# Altium schematic sheet Power Manengement.SchDoc: Wireles Securty Detector
size 420 x 297 mm; Date: 04.01.2024; CheckedBy: Arda B.; DrawnBy: Arda Bozkurt; DocumentNumber: 3; Revision: 001; SheetNumber: 3; SheetTotal: 5; Size: A3; Department: HDD
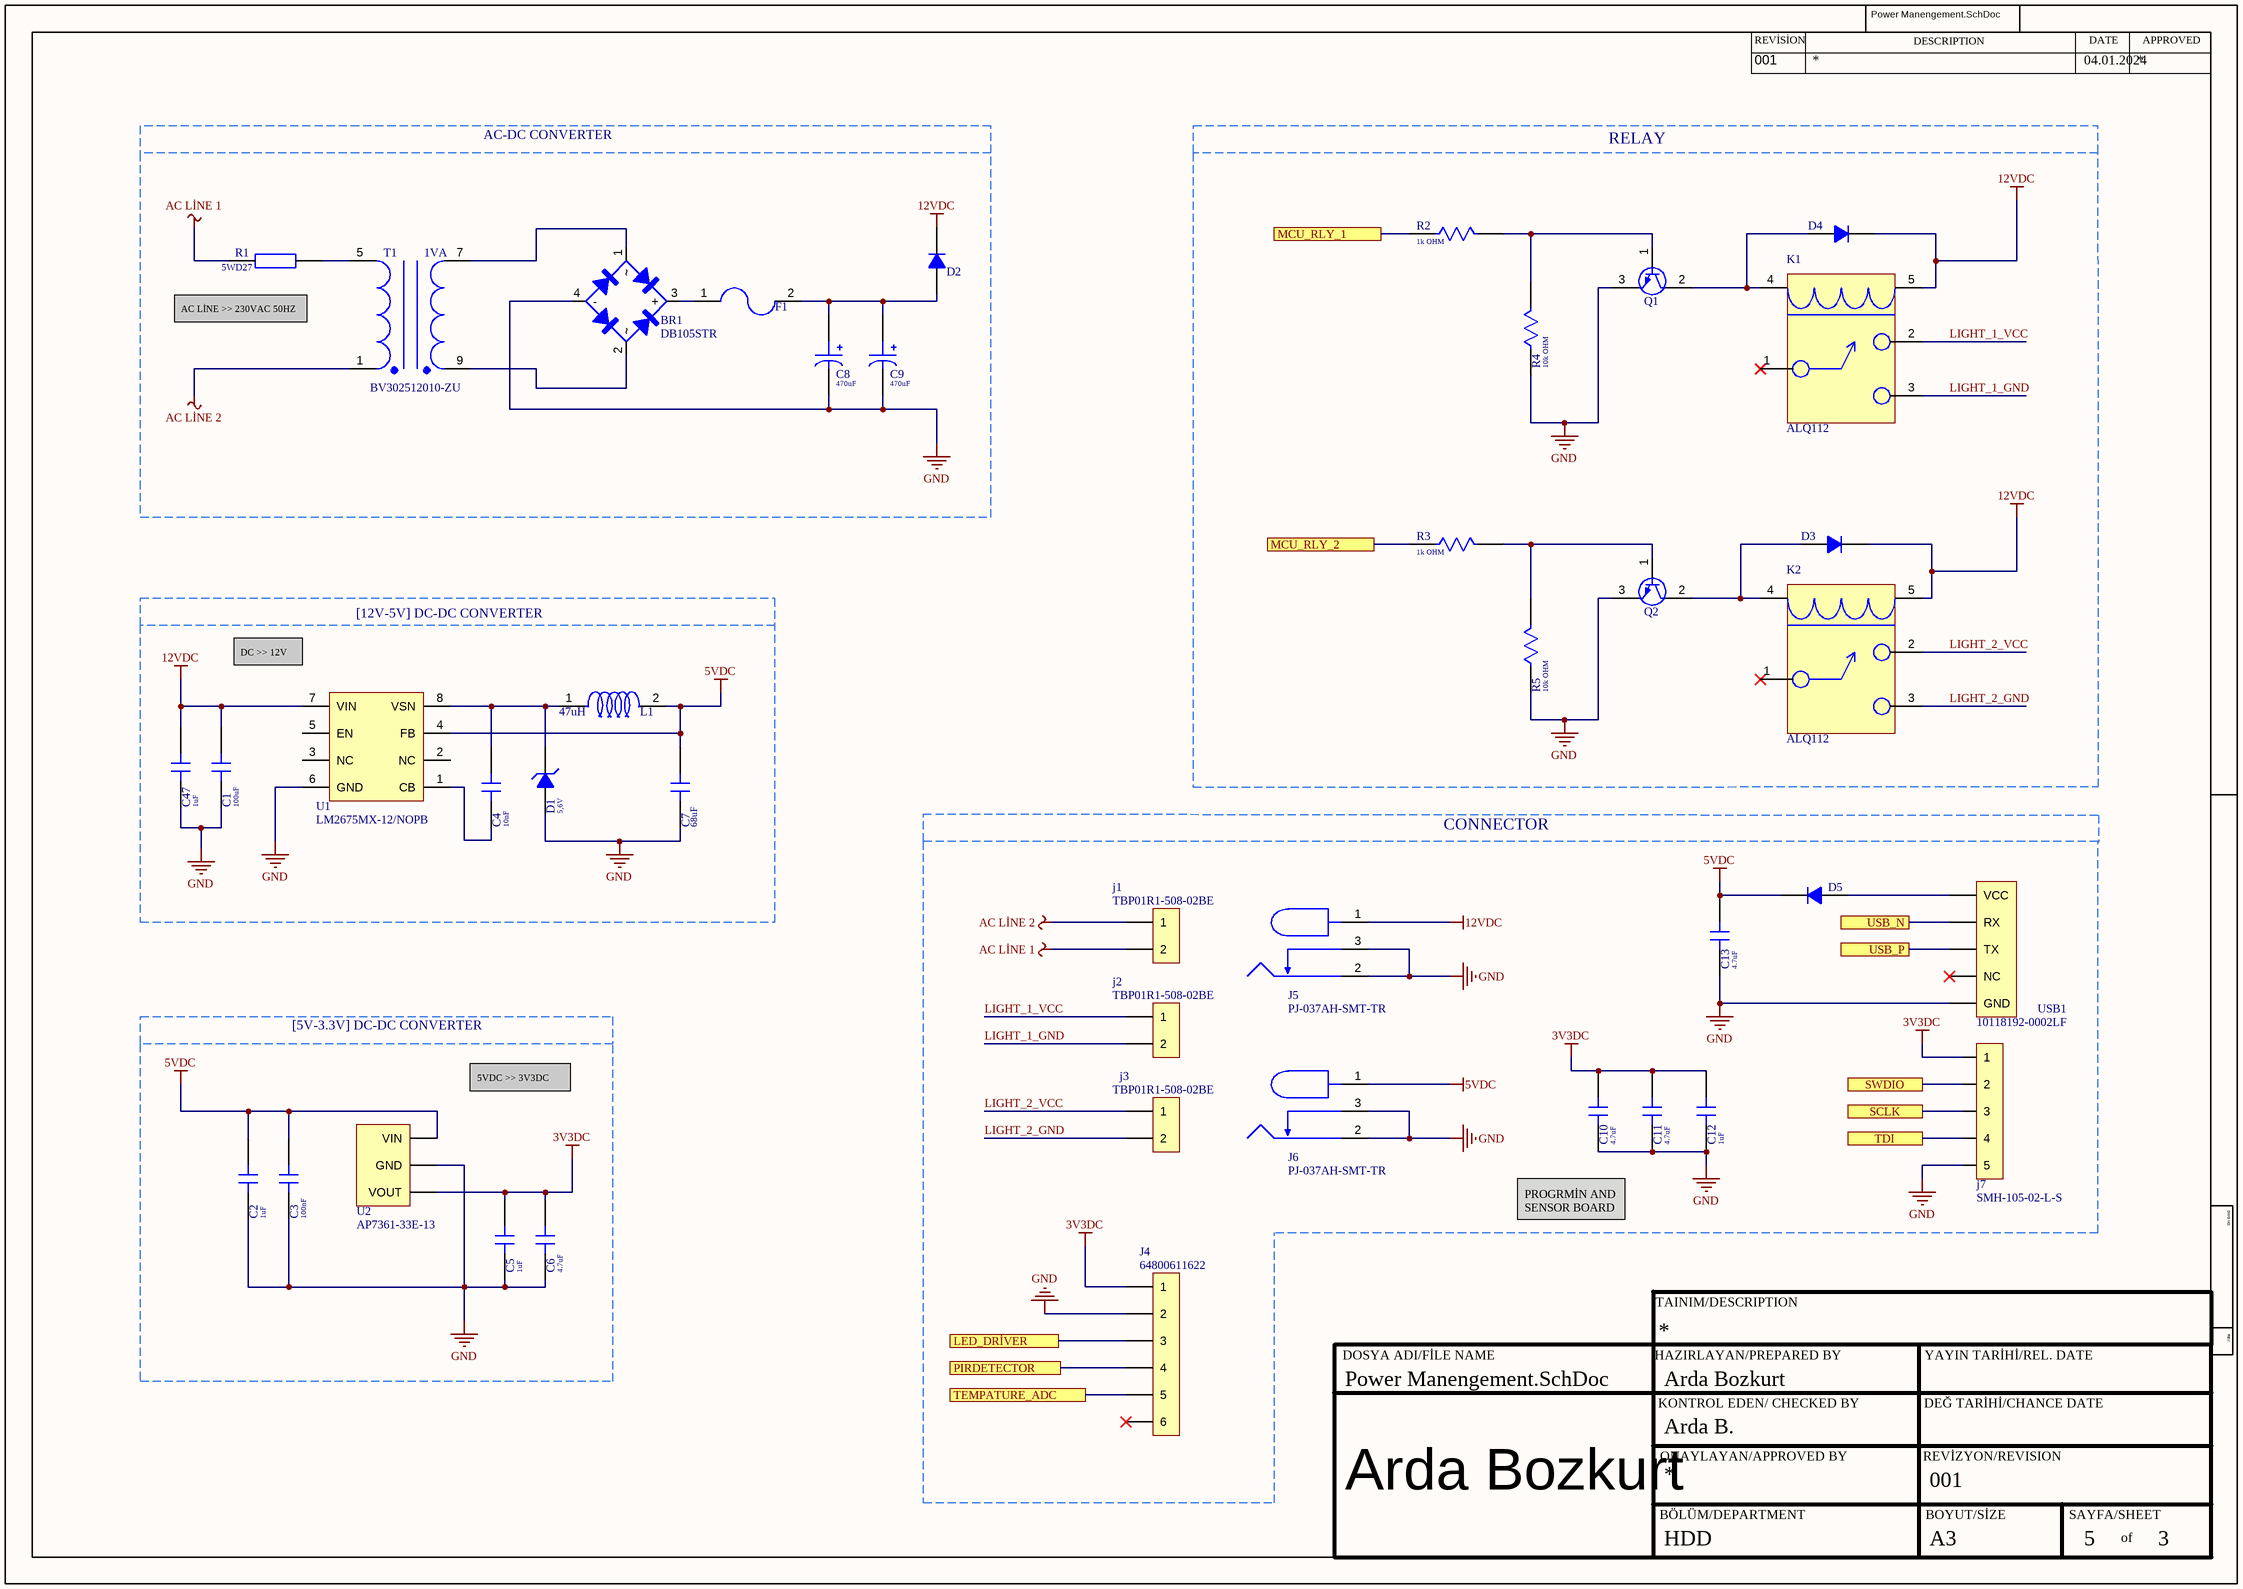
[diagram p0: Power Manengement.SchDoc]

## Parts
BR1  DB105STR  [DB105STR]
C1  value 100uF  [CAP-0805]  (hidden comment: GRM21BR60G107ME11K)
C2  value 1uF  [CAP-0805]  (hidden comment: CL21B105KAFNNNE)
C3  value 100nF  [CAP-0603]  (hidden comment: C0603C104KRACTU)
C4  value 10nF  [CAP-0603]  (hidden comment: 0603B103K160CT)
C5  value 1uF  [CAP-0805]  (hidden comment: CL21B105KAFNNNE)
C6  value 4.7uF  [CAP-0805]  (hidden comment: CL21A475KAQNNNE)
C7  value 68uF  [CAP ALUM HYB 68UF 20% 35V SMD]  (hidden comment: EEV686M035A9HAA)
C8  value 470uF  [CAP_RADİAL_D1_PS]  (hidden comment: ESH477M050AH4AA)
C9  value 470uF  [CAP_RADİAL_D1_PS]  (hidden comment: ESH477M050AH4AA)
C10  value 4.7uF  [CAP-0805]  (hidden comment: CL21A475KAQNNNE)
C11  value 4.7uF  [CAP-0805]  (hidden comment: CL21A475KAQNNNE)
C12  value 1uF  [CAP-0805]  (hidden comment: CL21B105KAFNNNE)
C13  value 4.7uF  [CAP-0805]  (hidden comment: CL21A475KAQNNNE)
C47  value 1uF  [CAP-0805]  (hidden comment: CL21B105KAFNNNE)
D1  Workin Voltage: 5,6V  [DİODE403A-03]  (hidden comment: 1SMB5919BT3G)
D2  1N4148WS  [SOT-323]  (value not drawn)
D3  1N4148WS  [SOT-323]  (value not drawn)
D4  1N4148WS  [SOT-323]  (value not drawn)
D5  1N4148WS  [SOT-323]  (value not drawn)
F1  3413.0216.22  [FUSE-1206]  (value not drawn)
j1  TBP01R1-508-02BE  [TBP01R1-508-02BE]
j2  TBP01R1-508-02BE  [TBP01R1-508-02BE]
j3  TBP01R1-508-02BE  [TBP01R1-508-02BE]
J4  64800611622  [PİN_HEADER_1X6]
J5  PJ-037AH-SMT-TR  [JACK]
J6  PJ-037AH-SMT-TR  [JACK]
j7  SMH-105-02-L-S  [PİN HEADER 1X5 RA]
K1  ALQ112  [ALQ112]
K2  ALQ112  [ALQ112]
L1  value 47uH  [IND 1212]  (hidden comment: 78438335470)
Q1  MMBT3904-7-F  [SOT23-3]  (value not drawn)
Q2  MMBT3904-7-F  [SOT23-3]  (value not drawn)
R1  5WD27  [5WD27]
R2  value 1k OHM  [RES-0603]  (hidden comment: RMCF0603FT1K00)
R3  value 1k OHM  [RES-0603]  (hidden comment: RMCF0603FT1K00)
R4  value 10k OHM  [RES-0603]  (hidden comment: RC0603FR-0710KL)
R5  value 10k OHM  [RES-0603]  (hidden comment: RC0603FR-0710KL)
T1  BV302512010-ZU  Rated Power: 1VA  [BV302512010-ZU]
U1  LM2675MX-12/NOPB  [SOIC-8]
U2  AP7361-33E-13  [SOT223]
USB1  10118192-0002LF  [MİCRO_B_USB]

## Blocks framed on the sheet
AC-DC CONVERTER: BR1 C8 C9 D2 F1 R1 T1
RELAY: D3 D4 K1 K2 Q1 Q2 R2-R5
[12V-5V] DC-DC CONVERTER: C1 C4 C7 C47 D1 L1 U1

## Ports
LED_DRİVER (see Microcontroller[3B]), MCU_RLY_1 (see Microcontroller[3B]), MCU_RLY_2 (see Microcontroller[3B]), PIRDETECTOR (see Microcontroller[3B]), SCLK (see Microcontroller[1B]), SWDIO (see Microcontroller[1B]), TDI (see Microcontroller[1B]), TEMPATURE_ADC (see Microcontroller[1B]), USB_N (see Microcontroller[3A]), USB_P (see Microcontroller[3A])

## Nets
3V3DC: C5.2 C6.2 C10.2 C11.2 C12.2 J4.1 j7.1 U2.3(VOUT)
5VDC: C2.2 C3.2 C7.2 C13.2 D5.1 J6.1(VCC) L1.2 U1.4(FB) U2.1(VIN)
12VDC: C1.2 C47.2 D2.1 D3.1 D4.1 J5.1(VCC) K1.5 K2.5 U1.7(VIN)
AC LİNE 1: j1.2 R1.1
AC LİNE 2: j1.1 T1.1
GND: BR1.4(-) C1.1 C2.1 C3.1 C5.1 C6.1 C7.1 C8.2 C9.2 C10.1 C11.1 C12.1 C13.1 C47.1 D1.1 J4.2 J5.2(GND) J5.3(SH) J6.2(GND) J6.3(SH) j7.5 Q1.3(E) Q2.3(E) R4.1 R5.1 U1.6(GND) U2.2(GND) USB1.5(GND)
LED_DRİVER: J4.3 ; port LED_DRİVER
LIGHT_1_GND: j2.2 K1.3
LIGHT_1_VCC: j2.1 K1.2
LIGHT_2_GND: j3.2 K2.3
LIGHT_2_VCC: j3.1 K2.2
MCU_RLY_1: R2.1 ; port MCU_RLY_1
MCU_RLY_2: R3.1 ; port MCU_RLY_2
PIRDETECTOR: J4.4 ; port PIRDETECTOR
SCLK: j7.3 ; port SCLK
SWDIO: j7.2 ; port SWDIO
TDI: j7.4 ; port TDI
TEMPATURE_ADC: J4.5 ; port TEMPATURE_ADC
USB_N: USB1.2(RX) ; port USB_N
USB_P: USB1.3(TX) ; port USB_P
NetBR1_1: BR1.1 T1.7
NetBR1_2: BR1.2 T1.9
NetBR1_3: BR1.3(+) F1.1
NetC4_1: C4.1 D1.2 L1.1 U1.8(VSN)
NetC4_2: C4.2 U1.1(CB)
NetC8_1: C8.1 C9.1 D2.2 F1.2
NetD3_2: D3.2 K2.4 Q2.2(C)
NetD4_2: D4.2 K1.4 Q1.2(C)
NetD5_2: D5.2 USB1.1(VCC)
NetQ1_1: Q1.1(B) R2.2 R4.2
NetQ2_1: Q2.1(B) R3.2 R5.2
NetR1_2: R1.2 T1.5

Not connected (* = marked no-connect by the designer): J4 6*; K1 1 *; K2 1 *; U1 2(NC) 3(NC) 5(EN); USB1 4(NC)*

## Notes on the sheet
- (near R1) AC LİNE >> 230VAC 50HZ
- (near U1) DC >> 12V
- CONNECTOR
- [5V-3.3V] DC-DC CONVERTER
- 5VDC >> 3V3DC
- PROGRMİN AND SENSOR BOARD
- REVİSİON
- DESCRIPTION
- DATE
- APPROVED
- DWG NO:
- TAINIM/DESCRIPTION
- REV:
- DOSYA ADI/FİLE NAME
- HAZIRLAYAN/PREPARED BY
- KONTROL EDEN/ CHECKED BY
- YAYIN TARİHİ/REL. DATE
- DEĞ TARİHİ/CHANCE DATE
- ONAYLAYAN/APPROVED BY
- REVİZYON/REVISION
- Arda Bozkurt
- BÖLÜM/DEPARTMENT
- BOYUT/SİZE
- SAYFA/SHEET
- of

## Library data of the parts
BR1 = DB105STR: Bridge Rect 1PHASE 600V 1A Db-s; Manufacturer: Sangdest Microelectronics; Manufacturer Part Number: DB105S; Designed By: Arda B.; Supplier: Digi-Key; Supplier Part Number: 1655-DB105SCT-ND; RoHS: No; Category: Uncategorized; Stock: 16246; Pricing: 1=0,41, 10=0,29, 100=0,1464, 500=0,12978 (USD); Operating Voltage: 600V; Max Current: 1A
C1 = CAP CER 100uF 0805: Cap 100UF 4VDC X5R 20% SMD 0805 Embossed Tape; Manufacturer: Murata; Voltage Rating (DC): 4V; Designed By: Arda B.; Supplier: Digikey; Supplier Part Number: 490-GRM21BR60G107ME11KCT-ND; Manufacturer Part Number: GRM21BR60G107ME11K; RoHS: Yes; Category: Ceramic Capacitors; Stock: 12136; Pricing: 1=0,61, 10=0,409, 50=0,3256, 100=0,269, 500=0,21012, 1000=0,1786, 2500=0,1681, 5000=0,15759 (USD); Dielectric: X5R; Tolerance: 20%; Length: 2mm; Width: 1.25mm; Thickness: 1.25mm; RoHS Compliant: Yes
C2 C5 C12 C47 = CAP CER 1uF 0805: Multilayer Ceramic Capacitor, 1 uF, 25 V, ± 10%, X7R, 0805 [2012 Metric]; Manufacturer: Samsung; Voltage: 25V; Designed By: Arda B.; Supplier: Digi-Key; Supplier Part Number: 1276-1066-6-ND; Manufacturer Part Number: CL21B105KAFNNNE; RoHS: Yes; Category: Ceramic Capacitors; Stock: 1108684; Pricing: 1=0,1, 10=0,062, 50=0,0356, 100=0,0276, 500=0,02078, 1000=0,01633 (USD); Mounting Technology: Surface Mount; Case/Package: 0805; Case Code (Metric): 2012; Case Code (Imperial): 0805; Min Operating Temperature: -55°C; Max Operating Temperature: 125°C; Tolerance: 10%; Dielectric: X7R; Voltage Rating (DC): 25V; Series: CL; Packaging: Tape and Reel; Voltage Rating: 25V; Package Quantity: 1; Construction: Flat; Length: 2mm; Width: 0.049inch; Height: 1.25mm; Depth: 1.25mm; Thickness: 0.053inch; Radiation Hardening: No; Lead Free: Lead Free; RoHS Compliant: Yes; ComponentLink1URL: https://datasheet.ciiva.com/25800/cl21b105kafnnne-25800163.pdf?src-supplier=Digi-Key; ComponentLink1Description: https://datasheet.ciiva.com/25800/cl21b105kafnnne-25800163.pdf?src-supplier=Digi-Key; ComponentLink2URL: https://datasheet.ciiva.com/15195/getdatasheetpartid-355205-15195880.pdf?src-supplier=Verical; ComponentLink2Description: https://datasheet.ciiva.com/15195/getdatasheetpartid-355205-15195880.pdf?src-supplier=Verical
C3 = CAP CER 100nF 0603: Capacitor, 0.1UF, 100V, MLCC, 0603;; Manufacturer: KEMET; Manufacturer Part Number: C0603C104K1RACTU; Dielectric: 1511DielectricType; Designed By: Arda B.; Supplier: Digi-Key; Supplier Part Number: 399-C0603C104K1RACTUCT-ND; RoHS: No; Category: Ceramic Capacitors; Stock: 4405; Pricing: 1=0,28, 10=0,185, 50=0,1296, 100=0,1047, 500=0,07782, 1000=0,06808 (USD); Case/Package: 345Case; Voltage Rating (DC): 100V
C4 = CAP CER 10nF 0603: 0603 16V X7R .01uF 10% multilayer ceramic capacitor; Manufacturer: Walsin Technologies; Designed By: Arda B.; Supplier: Digi-Key; Supplier Part Number: 1292-1384-1-ND; Manufacturer Part Number: 0603B103K160CT; RoHS: Yes; Category: Ceramic Capacitors; Stock: 116602; Pricing: 1=0,1, 10=0,032, 50=0,0182, 100=0,0141, 500=0,0106, 1000=0,00833 (USD); Lead Free: 5697LeadFree; ComponentLink1URL: http://www.farnell.com/datasheets/1958513.pdf?src-supplier=Farnell; ComponentLink1Description: http://www.farnell.com/datasheets/1958513.pdf?src-supplier=Farnell; ComponentLink2URL: http://www.passivecomponent.com/wp-content/uploads/2018/10/MLCC.pdf?src-supplier=Digi-Key; ComponentLink2Description: http://www.passivecomponent.com/wp-content/uploads/2018/10/MLCC.pdf?src-supplier=Digi-Key; ComponentLink3URL: https://datasheet.octopart.com/0603B103K160CT-Walsin-Technologies-datasheet-85392065.pdf?src-supplier=Element14; ComponentLink3Description: https://datasheet.octopart.com/0603B103K160CT-Walsin-Technologies-datasheet-85392065.pdf?src-supplier=Element14; ComponentLink4URL: https://datasheet.octopart.com/0603B103K160CT-Walsin-Technologies-datasheet-136037192.pdf?src-supplier=Future+Electronics; ComponentLink4Description: https://datasheet.octopart.com/0603B103K160CT-Walsin-Technologies-datasheet-136037192.pdf?src-supplier=Future+Electronics; ComponentLink5URL: https://datasheet.octopart.com/0603B103K160CT-Walsin-Technologies-datasheet-62066062.pdf?src-supplier=TME; ComponentLink5Description: https://datasheet.octopart.com/0603B103K160CT-Walsin-Technologies-datasheet-62066062.pdf?src-supplier=TME
C6 C10 C11 C13 = CAP CER 4.7uF 0805: Multilayer Ceramic Capacitor, 4.7 uF, 25 V, ± 10%, X5R, 0805 [2012 Metric]; Manufacturer: Samsung; Voltage Rating: 25V; Designed By: Arda B.; Supplier: Digi-Key; Supplier Part Number: 1276-1244-1-ND; Manufacturer Part Number: CL21A475KAQNNNE; RoHS: Yes; Category: Ceramic Capacitors; Stock: 3410220; Pricing: 1=0,1, 10=0,069, 50=0,0414, 100=0,0326, 500=0,02408, 1000=0,01994 (USD); Mounting Technology: Surface Mount; Case/Package: 0805; Case Code (Metric): 2012; Case Code (Imperial): 0805; Material: Ceramic; Min Operating Temperature: -55°C; Max Operating Temperature: 85°C; Packaging: Tape and Reel; Tolerance: 10%; Dielectric: X5R; Voltage Rating (DC): 25V; Series: CL; Construction: Flat; Length: 2mm; Height: 1.25mm; Depth: 1.25mm; Radiation Hardening: No; Lead Free: Lead Free; RoHS Compliant: Yes; ComponentLink1URL: https://datasheet.ciiva.com/25798/cl21a475kaqnnne-25798882.pdf?src-supplier=Digi-Key; ComponentLink1Description: https://datasheet.ciiva.com/25798/cl21a475kaqnnne-25798882.pdf?src-supplier=Digi-Key
C7 = CAP ALUM 68UF: Cap Aluminum Lytic 68uF 35V 20%( 6.3 X 7.7mm) SMD 0.34 Ohm 280mA 2000h 105C T/R; Manufacturer: KEMET; Designed By: Arda B.; Supplier: Mouser; Supplier Part Number: 80-EEV686M035A9HAA; Manufacturer Part Number: EEV686M035A9HAA; RoHS: Yes; Category: Aluminum Electrolytic Capacitors; Stock: 14057; Pricing: 1=0,44, 10=0,299, 50=0,299, 100=0,203, 1000=0,16, 10000=0,139 (USD); ComponentLink1URL: https://datasheet.ciiva.com/5365/kem-a4002-eev-535332-5365784.pdf?src-supplier=Mouser; ComponentLink1Description: https://datasheet.ciiva.com/5365/kem-a4002-eev-535332-5365784.pdf?src-supplier=Mouser
C8 C9 = CAP ALUM  POL 470UF: Cap, 470UF, 50V, Alu Elec, Radial; Manufacturer: KEMET; Supplier: Mouser; Supplier Part Number: 80-ESH477M050AH4AA; Manufacturer Part Number: ESH477M050AH4AA; RoHS: Yes; Stock: 7720; Pricing: 1=0,57, 10=0,32, 50=0,32, 100=0,215, 1000=0,165, 10000=0,149 (USD); ComponentLink1URL: https://api.kemet.com/component-edge/download/datasheet/ESH477M050AH4AA.pdf?src-supplier=Digikey; ComponentLink1Description: https://api.kemet.com/component-edge/download/datasheet/ESH477M050AH4AA.pdf?src-supplier=Digikey; ComponentLink2URL: https://datasheet.octopart.com/ESH477M050AH4AA-KEMET-datasheet-130075338.pdf?src-supplier=Newark; ComponentLink2Description: https://datasheet.octopart.com/ESH477M050AH4AA-KEMET-datasheet-130075338.pdf?src-supplier=Newark
D1 = 1SMB5919BT3G: Vz=5.6V 5.32V~5.88V Izt=66.9mA; Manufacturer: ON Semiconductor; Designed By: Arda B.; Supplier: Future Electronics; Supplier Part Number: 2411643; Manufacturer Part Number: 1SMB5919BT3G; RoHS: Yes; Category: Zener Diodes; Stock: 48000; Pricing: 2500=0,0873, 7500=0,0839, 12500=0,0824, 25000=0,0803, 50000=0,0772 (USD); ComponentLink1URL: https://datasheet.ciiva.com/27747/1308331-27747654.pdf?src-supplier=Jameco; ComponentLink1Description: https://datasheet.ciiva.com/27747/1308331-27747654.pdf?src-supplier=Jameco; ComponentLink2URL: https://datasheet.ciiva.com/895/1smb5913bt3-d-895203.pdf?src-supplier=Digi-Key; ComponentLink2Description: https://datasheet.ciiva.com/895/1smb5913bt3-d-895203.pdf?src-supplier=Digi-Key; ComponentLink3URL: https://datasheet.ciiva.com/895/1smb5913bt3-d-895204.pdf?src-supplier=Digi-Key; ComponentLink3Description: https://datasheet.ciiva.com/895/1smb5913bt3-d-895204.pdf?src-supplier=Digi-Key; ComponentLink4URL: https://datasheet.ciiva.com/895/1smb5913bt3-d-895205.pdf?src-supplier=Digi-Key; ComponentLink4Description: https://datasheet.ciiva.com/895/1smb5913bt3-d-895205.pdf?src-supplier=Digi-Key; ComponentLink5URL: https://datasheet.ciiva.com/15198/getdatasheetpartid-311040-15198695.pdf?src-supplier=Verical; ComponentLink5Description: https://datasheet.ciiva.com/15198/getdatasheetpartid-311040-15198695.pdf?src-supplier=Verical; ComponentLink6URL: https://datasheet.ciiva.com/1182/1smb5913bt3-d-1182657.pdf?src-supplier=Element14; ComponentLink6Description: https://datasheet.ciiva.com/1182/1smb5913bt3-d-1182657.pdf?src-supplier=Element14; ComponentLink7URL: https://datasheet.ciiva.com/1182/1smb5913bt3-d-1182658.pdf?src-supplier=Element14; ComponentLink7Description: https://datasheet.ciiva.com/1182/1smb5913bt3-d-1182658.pdf?src-supplier=Element14; ComponentLink8URL: https://datasheet.ciiva.com/16311/1smb5913bt3-d-16311847.pdf?src-supplier=Future+Electronics; ComponentLink8Description: https://datasheet.ciiva.com/16311/1smb5913bt3-d-16311847.pdf?src-supplier=Future+Electronics
D2-D5 = DIODE  75V 150MA SOD323F: Diode Ultra Fast Recovery Rectifier 75V 0.15A 2-Pin SOD-323F T/R; Manufacturer: ON Semiconductor / Fairchild; Max Forward Surge Current (Ifsm): 2A; Forward Current: 150mA; Max Reverse Current: 5uA; Value: 4pF; Reverse Recovery Time: 4ns; Element Configuration: Single; Designed By: Arda B.; Supplier: Digi-Key; Supplier Part Number: 1N4148WSFSCT-ND; Manufacturer Part Number: 1N4148WS; RoHS: Yes; Category: Rectifier Diodes; Stock: 1155588; Pricing: 1=0,19, 10=0,136, 100=0,0733, 500=0,0576, 1000=0,04 (USD); Mounting Technology: Surface Mount; Pins: 2; Weight: 0.0276g; Min Operating Temperature: -55°C; Max Operating Temperature: 150°C; Packaging: Tape and Reel; Average Rectified Current: 150mA; Max Repetitive Reverse Voltage (Vrrm): 75V; Max Reverse Voltage (DC): 75V; Series: -; Package Quantity: 1; Reverse Voltage: 75V; Recovery Time: 4ns; Length: 1.8mm; Width: 1.35mm; Height: 1mm; Radiation Hardening: No; RoHS Compliant: Yes; Reach SVHC Compliant: No; Lead Free: Lead Free; ComponentLink1URL: https://datasheet.ciiva.com/15208/getdatasheetpartid-127819-15208358.pdf?src-supplier=Verical; ComponentLink1Description: https://datasheet.ciiva.com/15208/getdatasheetpartid-127819-15208358.pdf?src-supplier=Verical; ComponentLink2URL: https://datasheet.ciiva.com/8300/1n914bws-8300360.pdf?src-supplier=Avnet; ComponentLink2Description: https://datasheet.ciiva.com/8300/1n914bws-8300360.pdf?src-supplier=Avnet; ComponentLink3URL: https://datasheet.ciiva.com/910/1n4148ws-910381.pdf?src-supplier=Digi-Key; ComponentLink3Description: https://datasheet.ciiva.com/910/1n4148ws-910381.pdf?src-supplier=Digi-Key; ComponentLink4URL: https://datasheet.ciiva.com/910/1n4148ws-910382.pdf?src-supplier=Digi-Key; ComponentLink4Description: https://datasheet.ciiva.com/910/1n4148ws-910382.pdf?src-supplier=Digi-Key; ComponentLink5URL: https://datasheet.ciiva.com/910/1n4148ws-910380.pdf?src-supplier=Digi-Key; ComponentLink5Description: https://datasheet.ciiva.com/910/1n4148ws-910380.pdf?src-supplier=Digi-Key
F1 = FUSE 3413.0216.22: Fuse Chip Fast Acting 1A 32V SMD Solder Pad 1206 Glass T/R VDE/cULus; Manufacturer: Schurter; Body Material: Glass,Epoxy; Voltage Rating (DC): 63V; DC Cold Resistance: 94.2mR; Fuse Type: Board Mount (Cartridge Style Excluded); Approvals: VDE,cURus; Designed By: Arda B.; Supplier: Digi-Key; Supplier Part Number: 486-1144-1-ND; Manufacturer Part Number: 3413.0216.22; RoHS: Yes; Category: Fuses; Stock: 19073; Pricing: 1=0,67, 50=0,524, 100=0,397, 500=0,345 (USD); Mounting Technology: Surface Mount,PCB; Case/Package: 1206; Pins: 2; Weight: 0.000212oz; Case Code (Metric): 3216; Case Code (Imperial): 1206; Contact Plating: Gold; Terminal Material: Tin; Min Operating Temperature: -55°C; Max Operating Temperature: 90°C; Current Rating: 1A; Package Quantity: 1000; Voltage Rating (AC): 32V; Packaging: Tape and Reel; Voltage Rating: 32V; Termination: SMD/SMT; Working Voltage: 32V; Series: USI 1206; Length: 3.2mm; Width: 1.6mm; Height: 0.6mm; Lead Free: Lead Free; RoHS Compliant: Yes; ComponentLink1URL: https://datasheet.ciiva.com/301/typ-usi-1206-301440.pdf?src-supplier=Digi-Key; ComponentLink1Description: https://datasheet.ciiva.com/301/typ-usi-1206-301440.pdf?src-supplier=Digi-Key; ComponentLink2URL: https://datasheet.ciiva.com/8264/typ-usi-1206-8264583.pdf?src-supplier=Avnet; ComponentLink2Description: https://datasheet.ciiva.com/8264/typ-usi-1206-8264583.pdf?src-supplier=Avnet; ComponentLink3URL: https://datasheet.ciiva.com/16316/typ-usi-1206-16316588.pdf?src-supplier=Future+Electronics; ComponentLink3Description: https://datasheet.ciiva.com/16316/typ-usi-1206-16316588.pdf?src-supplier=Future+Electronics; ComponentLink4URL: https://datasheet.ciiva.com/301/typ-usi-1206-301439.pdf?src-supplier=Digi-Key; ComponentLink4Description: https://datasheet.ciiva.com/301/typ-usi-1206-301439.pdf?src-supplier=Digi-Key; ComponentLink5URL: https://datasheet.ciiva.com/14541/70160006-14541114.pdf?src-supplier=Allied+Electronics; ComponentLink5Description: https://datasheet.ciiva.com/14541/70160006-14541114.pdf?src-supplier=Allied+Electronics; ComponentLink6URL: https://datasheet.ciiva.com/14102/qousi1206-data-e-14102903.pdf?src-supplier=Distrelec; ComponentLink6Description: https://datasheet.ciiva.com/14102/qousi1206-data-e-14102903.pdf?src-supplier=Distrelec; ComponentLink7URL: https://datasheet.ciiva.com/301/typ-usi-1206-301441.pdf?src-supplier=Digi-Key; ComponentLink7Description: https://datasheet.ciiva.com/301/typ-usi-1206-301441.pdf?src-supplier=Digi-Key
j1-j3 = TERMINAL BLOCK, PLUGGABLE, 5.08,: 2~24 Poles, Pluggable, Receptacle, Horizontal, 5.08 Pitch, Terminal Block Connector; Manufacturer: CUI Devices; Designed By: Arda B.; Supplier: Digi-Key; Supplier Part Number: 102-6406-ND; Manufacturer Part Number: TBP01R1-508-02BE; RoHS: Yes; Category: Terminal Blocks; Stock: 106815; Pricing: 1=0,48, 10=0,252, 25=0,1788, 50=0,152, 100=0,1466, 250=0,12396, 500=0,11464, 1000=0,10131, 5000=0,07731 (USD); ComponentLink1URL: https://www.cuidevices.com/product/resource/digikeypdf/tbp01r1-508.pdf?src-supplier=Digi-Key; ComponentLink1Description: https://www.cuidevices.com/product/resource/digikeypdf/tbp01r1-508.pdf?src-supplier=Digi-Key; ComponentLink2URL: https://datasheet.octopart.com/TBP01R1-508-02BE-CUI-Devices-datasheet-147843976.pdf?src-supplier=Future+Electronics; ComponentLink2Description: https://datasheet.octopart.com/TBP01R1-508-02BE-CUI-Devices-datasheet-147843976.pdf?src-supplier=Future+Electronics; ComponentLink3URL: https://datasheet.octopart.com/TBP01R1-508-02BE-CUI-Devices-datasheet-154730754.pdf?src-supplier=Electro+Sonic; ComponentLink3Description: https://datasheet.octopart.com/TBP01R1-508-02BE-CUI-Devices-datasheet-154730754.pdf?src-supplier=Electro+Sonic
J4 = PİN HEADER 1X6: WR-WTB Wire-to-Board Connectors 1.50 mm; Manufacturer: Wurth Electronics; Designed By.: Arda B.; Supplier: Digi-Key; Supplier Part Number: 732-64800611622-ND; Manufacturer Part Number: 64800611622; RoHS: No; Category: Uncategorized; Stock: 544; Pricing: 1=0,42, 50=0,406, 100=0,384, 250=0,361, 500=0,339 (USD)
J5 J6 = CONN PWR JACK 2X5.5MM: 2.0 x 6.3 mm, 5.0 A, Horizontal, Surface Mount (SMT), Dc Power Jack Connector; Manufacturer: CUI; Designed By: Arda B.; Number of Conductors: 2; Gender: Male; Shielding: Unshielded; Current Rating: 5A; Voltage Rating: 24V; Insulation Resistance: 100MR; Supplier: Mouser; Supplier Part Number: 490-PJ-037AH-SMT-TR; Manufacturer Part Number: PJ-037AH-SMT-TR; RoHS: Yes; Category: Uncategorized; Mounting Technology: Surface Mount,Through Hole; Case/Package: SMD/SMT; Color: Black; Contact Material: Copper; Contact Plating: Nickel; Housing Color: Black; Housing Material: Thermoplastic; Min Operating Temperature: -25°C; Max Operating Temperature: 85°C; Orientation: Horizontal; Package Quantity: 200; Termination: Solder; Connector Type: Jack; Contact Gender: Male; Packaging: Tape and Reel; Flammability Rating: UL94 V-0; ComponentLink1URL: http://www.mouser.com/ds/2/670/pj-037ah-smt-516065.pdf?src-supplier=Mouser; ComponentLink1Description: http://www.mouser.com/ds/2/670/pj-037ah-smt-516065.pdf?src-supplier=Mouser; ComponentLink2URL: https://www.cui.com/product/resource/digikeypdf/pj-037ah-smt-tr.pdf?src-supplier=Digi-Key; ComponentLink2Description: https://www.cui.com/product/resource/digikeypdf/pj-037ah-smt-tr.pdf?src-supplier=Digi-Key; ComponentLink3URL: http://www.cui.com/product/resource/digikeypdf/pj-037ah-smt.pdf?src-supplier=Digi-Key; ComponentLink3Description: http://www.cui.com/product/resource/digikeypdf/pj-037ah-smt.pdf?src-supplier=Digi-Key
j7 = SMH-105-02-L-S: Samtec - SMH-105-02-L-S - Receptacle, 2.54MM, Tht, R/a, 5WAY; DEsigned By: Arda B.; Number of Contacts: 5; Supplier: Digi-Key; Supplier Part Number: SAM11813-ND; Manufacturer: Samtec; Manufacturer Part Number: SMH-105-02-L-S; RoHS: Yes; Category: Connectors; Stock: 38; Pricing: 1=2,18, 10=1,899, 100=1,6968, 500=1,414, 1000=1,212, 5000=1,07464 (USD); Contact Plating: Gold; Contact Material: Bronze; Contact Finish - Mating: GOLD; Insulation Color: Black; Insulation Material: Polymer; Contact Shape: Square; Min Operating Temperature: -55°C; Max Operating Temperature: 125°C; Packaging: Rail/Tube; Number of Rows: 1; Termination: Solder; Gender: Receptacle; Orientation: Horizontal; Connector Type: Receptacle; Fastening Type: Pull; Series: SMH; Contact Type: Forked; Number of Positions: 5; Pitch: 2.54mm; Radiation Hardening: No; RoHS Compliant: Yes; Reach SVHC Compliant: No; Flammability Rating: UL94 V-0; ComponentLink1URL: http://www.farnell.com/datasheets/1927708.pdf?_ga=2.237598468.569325269.1503285096-1413671594.1503025027&src-supplier=Farnell; ComponentLink1Description: http://www.farnell.com/datasheets/1927708.pdf?_ga=2.237598468.569325269.1503285096-1413671594.1503025027&src-supplier=Farnell; ComponentLink2URL: http://www.samtec.com/documents/webfiles/pdf/SMH.PDF?src-supplier=Newark; ComponentLink2Description: http://www.samtec.com/documents/webfiles/pdf/SMH.PDF?src-supplier=Newark; ComponentLink3URL: http://www.samtec.com/documents/webfiles/pdf/SMH.PDF?src-supplier=Avnet; ComponentLink3Description: http://www.samtec.com/documents/webfiles/pdf/SMH.PDF?src-supplier=Avnet; ComponentLink4URL: http://suddendocs.samtec.com/catalog_english/smh.pdf?src-supplier=Digi-Key; ComponentLink4Description: http://suddendocs.samtec.com/catalog_english/smh.pdf?src-supplier=Digi-Key
K1 K2 = ALQ112: Electromechanical Relay 12VDC 360Ohm 10(NO)/3(NC)A SPDT (( 20mm 10mm 16mm)) THT Power Relay; Manufacturer: Panasonic; Designed By: Arda B.; Supplier: Digi-Key; Supplier Part Number: 255-3562-ND; Manufacturer Part Number: ALQ112; RoHS: Yes; Category: Power Relays; Stock: 456; Pricing: 1=1,28, 10=1,204, 25=1,0704, 50=1,017, 100=0,9635, 250=0,85648, 500=0,80296, 1000=0,74942, 5000=0,72266 (USD); ComponentLink1URL: https://datasheet.ciiva.com/24388/307ds-61b20-en-lq-24388909.pdf?src-supplier=Onlinecomponents.com; ComponentLink1Description: https://datasheet.ciiva.com/24388/307ds-61b20-en-lq-24388909.pdf?src-supplier=Onlinecomponents.com
L1 = IND 47UH 390MA 2.3 OHM SMD: Power Inductor, Aec-Q200, 47Uh, 0.39A Rohs Compliant: Yes |Wurth Elektronik 78438335470; Manufacturer: Wurth Electronics; Core Material: Ferrite; Current Rating: 390mA; Saturation Current: 1.18A; Shielding: Shielded; DC Resistance (DCR): 2.3R; Self Resonant Frequency: 8MHz; Test Frequency: 100kHz; Tolerance: 30%; Designed By: Arda B.; Supplier: Digi-Key; Supplier Part Number: 732-6947-1-ND; Manufacturer Part Number: 78438335470; RoHS: Yes; Category: Fixed Inductors; Stock: 14755; Pricing: 1=2,11, 50=1,97, 250=1,803, 500=1,672 (USD); Mounting Technology: Surface Mount; Case/Package: 1212; Case Code (Metric): 3030; Case Code (Imperial): 1212; Min Operating Temperature: -40°C; Max Operating Temperature: 125°C; Packaging: Cut Tape; Series: WE-MAIA; Length: 0.118inch; Width: 0.118inch; Height - Seated (Max): 0.059inch; Ratings: AEC-Q200; RoHS Compliant: Yes; ComponentLink1URL: https://media.digikey.com/pdf/Data%20Sheets/Wurth%20Electronics%20PDFs/Q+_Products_Flyer.pdf?src-supplier=Digi-Key; ComponentLink1Description: https://media.digikey.com/pdf/Data%20Sheets/Wurth%20Electronics%20PDFs/Q+_Products_Flyer.pdf?src-supplier=Digi-Key
Q1 Q2 = MMBT3904-7-F: Transistor General Purpose BJT NPN 40 Volt 0.2A Automotive 3-Pin SOT-23; Manufacturer: Diodes Zetex; Designed By: Arda B.; Max Power Dissipation: 300mW; Collector Emitter Voltage (VCEO): 40V; Max Collector Current: 200mA; Collector Base Voltage (VCBO): 60V; Power Dissipation: 350mW; Frequency: 300MHz; hFE Min: 100; Number of Elements: 1; Emitter Base Voltage (VEBO): 6V; Collector Emitter Saturation Voltage: 300mV; Supplier: Digi-Key; Supplier Part Number: MMBT3904-FDICT-ND; Manufacturer Part Number: MMBT3904-7-F; RoHS: Yes; Category: BJTs; Stock: 5390800; Pricing: 1=0,12, 10=0,086, 100=0,0467, 500=0,03666, 1000=0,02545 (USD); Mounting Technology: Surface Mount; Case/Package: SOT-23; Pins: 3; Weight: 0.000282oz; Min Operating Temperature: -55°C; Max Operating Temperature: 150°C; Polarity: NPN; Packaging: Tape and Reel; Package Quantity: 3000; Transition Frequency: 300MHz; Collector Emitter Breakdown Voltage: 40V; Max Breakdown Voltage: 40V; Continuous Collector Current: 200mA; Clock Frequency: 300MHz; Gain Bandwidth Product: 300MHz; Voltage Rating (DC): 40V; Series: Automotive, AEC-Q101; Collector-emitter Voltage-Max: 300mV; Length: 3.05mm; Width: 1.4mm; Height: 1mm; Radiation Hardening: No; Reach SVHC Compliant: No; Lead Free: Lead Free; RoHS Compliant: Yes; ComponentLink1URL: https://datasheet.ciiva.com/11201/ds30036-11201778.pdf?src-supplier=Avnet; ComponentLink1Description: https://datasheet.ciiva.com/11201/ds30036-11201778.pdf?src-supplier=Avnet; ComponentLink2URL: https://datasheet.ciiva.com/15138/getdatasheetpartid-53265-15138780.pdf?src-supplier=Verical; ComponentLink2Description: https://datasheet.ciiva.com/15138/getdatasheetpartid-53265-15138780.pdf?src-supplier=Verical; ComponentLink3URL: https://datasheet.ciiva.com/22711/1915516-22711750.pdf?src-supplier=Element14; ComponentLink3Description: https://datasheet.ciiva.com/22711/1915516-22711750.pdf?src-supplier=Element14; ComponentLink4URL: https://datasheet.ciiva.com/11198/ds30036-11198999.pdf?src-supplier=Avnet; ComponentLink4Description: https://datasheet.ciiva.com/11198/ds30036-11198999.pdf?src-supplier=Avnet; ComponentLink5URL: https://datasheet.ciiva.com/6361/ds30036-6361256.pdf?src-supplier=Digi-Key; ComponentLink5Description: https://datasheet.ciiva.com/6361/ds30036-6361256.pdf?src-supplier=Digi-Key; ComponentLink6URL: https://datasheet.ciiva.com/6361/ds30036-6361254.pdf?src-supplier=Digi-Key; ComponentLink6Description: https://datasheet.ciiva.com/6361/ds30036-6361254.pdf?src-supplier=Digi-Key
R1 = 5WD27: RES 0.27 OHM 5% 5W AXIAL; Manufacturer: Multicomp; Manufacturer Part Number: MP006029; Designed By: Arda B.; Supplier: Newark; Supplier Part Number: 17AJ6112; RoHS: No; Stock: 194; Pricing: 1=0,219, 250=0,166, 500=0,148, 1000=0,133, 5000=0,121 (USD)
R2 R3 = RES 1K OHM 0603: Res Thick Film 0603 1K Ohm 1% 0.1W(1/10W) ±100ppm/C Pad SMD Automotive T/R; Manufacturer: Stackpole Electronics; Designed By: Arda B.; Power Rating: 100mW; Temperature Coefficient: 100ppm/°C; Voltage Rating: 75V; Supplier: Digi-Key; Supplier Part Number: RMCF0603FT1K00CT-ND; Manufacturer Part Number: RMCF0603FT1K00; RoHS: Yes; Category: Chip SMD Resistors; Stock: 2889922; Pricing: 1=0,1, 10=0,015, 50=0,009, 100=0,0075, 500=0,00498, 1000=0,00425 (USD); Mounting Technology: Surface Mount; Case/Package: 0603; Case Code (Metric): 1608; Case Code (Imperial): 0603; Contact Plating: Tin,Matte; Min Operating Temperature: -55°C; Max Operating Temperature: 155°C; Tolerance: 1%; Packaging: Tape and Reel; Number of Terminations: 2; Max Power Dissipation: 100mW; Features: Automotive AEC-Q200; Series: RMCF; Construction: Rectangular; Length: 1.55mm; Width: 0.031inch; Height: 0.022inch; Depth: 0.8mm; Radiation Hardening: No; Military Standard: Not; Lead Free: Lead Free; RoHS Compliant: Yes; ComponentLink1URL: https://datasheet.octopart.com/RMCF0603FT1K00-Stackpole-Electronics-datasheet-11547379.pdf?src-supplier=Future+Electronics; ComponentLink1Description: https://datasheet.octopart.com/RMCF0603FT1K00-Stackpole-Electronics-datasheet-11547379.pdf?src-supplier=Future+Electronics; ComponentLink2URL: https://www.seielect.com/catalog/SEI-Packaging.pdf?src-supplier=Avnet; ComponentLink2Description: https://www.seielect.com/catalog/SEI-Packaging.pdf?src-supplier=Avnet; ComponentLink3URL: https://www.seielect.com/catalog/SEI-Packaging.pdf?src-supplier=Arrow+Electronics; ComponentLink3Description: https://www.seielect.com/catalog/SEI-Packaging.pdf?src-supplier=Arrow+Electronics; ComponentLink4URL: http://www.seielect.com/Catalog/SEI-rmc.pdf?src-supplier=Future+Electronics; ComponentLink4Description: http://www.seielect.com/Catalog/SEI-rmc.pdf?src-supplier=Future+Electronics; ComponentLink5URL: https://www.seielect.com/catalog/SEI-Packaging.pdf?src-supplier=Verical; ComponentLink5Description: https://www.seielect.com/catalog/SEI-Packaging.pdf?src-supplier=Verical; ComponentLink6URL: https://www.seielect.com/catalog/SEI-RMCF_RMCP.pdf?src-supplier=Avnet; ComponentLink6Description: https://www.seielect.com/catalog/SEI-RMCF_RMCP.pdf?src-supplier=Avnet; ComponentLink7URL: https://www.seielect.com/catalog/sei-rmcf_rmcp.pdf?src-supplier=Digi-Key; ComponentLink7Description: https://www.seielect.com/catalog/sei-rmcf_rmcp.pdf?src-supplier=Digi-Key; ComponentLink8URL: https://www.seielect.com/catalog/SEI-Packaging.pdf?src-supplier=Quest; ComponentLink8Description: https://www.seielect.com/catalog/SEI-Packaging.pdf?src-supplier=Quest; ComponentLink9URL: https://datasheet.octopart.com/RMCF0603FT1K00-Stackpole-Electronics-datasheet-155966809.pdf?src-supplier=Master+Electronics; ComponentLink9Description: https://datasheet.octopart.com/RMCF0603FT1K00-Stackpole-Electronics-datasheet-155966809.pdf?src-supplier=Master+Electronics
R4 R5 = RES 10K OHM 0603: SMD Chip Resistor, 10 kOhm, ± 1%, 100 mW, 0603 [1608 Metric], Thick Film, General Purpose; Manufacturer: Yageo; Voltage Rating (DC): 50V; Temperature Coefficient: 100ppm/°C; Power Rating: 100mW; Voltage Rating: 75V; Designed By: Arda B.; Supplier: Digi-Key; Supplier Part Number: 311-10.0KHRCT-ND; Manufacturer Part Number: RC0603FR-0710KL; RoHS: Yes; Category: Chip SMD Resistors; Stock: 24703208; Pricing: 1=0,1, 10=0,019, 50=0,0112, 100=0,0093, 500=0,00622, 1000=0,00532 (USD); Case/Package: 0603; Pins: 2; Case Code (Imperial): 0603; Case Code (Metric): 1608; Weight: 7.1E-05oz; Min Operating Temperature: -55°C; Max Operating Temperature: 155°C; Tolerance: 1%; Resistor Type: Thick Film; Packaging: Tape and Reel; Termination: SMD/SMT; Features: Moisture Resistant; Series: RC; Max Power Dissipation: 100mW; Number of Terminations: 2; Resistance Tolerance: 1%; Construction: Rectangular; Length: 1.6mm; Width: 0.8mm; Height: 0.45mm; Depth: 0.8mm; Lead Pitch: 0.3mm; Reach SVHC Compliant: No; Lead Free: 5697LeadFree; Military Standard: Not; RoHS Compliant: Yes; ComponentLink1URL: https://datasheet.ciiva.com/7660/38590-7660789.pdf?src-supplier=Element14; ComponentLink1Description: https://datasheet.ciiva.com/7660/38590-7660789.pdf?src-supplier=Element14; ComponentLink2URL: https://datasheet.ciiva.com/7983/443971-7983596.pdf?src-supplier=Element14; ComponentLink2Description: https://datasheet.ciiva.com/7983/443971-7983596.pdf?src-supplier=Element14; ComponentLink3URL: https://datasheet.ciiva.com/22747/443971-22747519.pdf?src-supplier=Element14; ComponentLink3Description: https://datasheet.ciiva.com/22747/443971-22747519.pdf?src-supplier=Element14; ComponentLink4URL: https://datasheet.ciiva.com/46440/1868787-46440891.pdf?src-supplier=Element14; ComponentLink4Description: https://datasheet.ciiva.com/46440/1868787-46440891.pdf?src-supplier=Element14; ComponentLink5URL: https://datasheet.ciiva.com/7746/1738695-7746239.pdf?src-supplier=Element14; ComponentLink5Description: https://datasheet.ciiva.com/7746/1738695-7746239.pdf?src-supplier=Element14; ComponentLink6URL: https://datasheet.ciiva.com/15189/getdatasheetpartid-409289-15189591.pdf?src-supplier=Verical; ComponentLink6Description: https://datasheet.ciiva.com/15189/getdatasheetpartid-409289-15189591.pdf?src-supplier=Verical
T1 = BV302512010-ZU: PWR XFMR LAMINATED 1VA TH; Manufactur Produce Number: BV302S12010-ZU; Manufacturer: Zettler Magnetics; Catogry: Power Transformers; Primary Voltage: 230V; Secondary Voltage: 12V; Operating Frequency: 5060Hz; Designed By: Arda B.; Package: Box; RoHS: No
U1 = LM2675MX-12/NOPB: SIMPLE SWITCHER® 6.5V to 40V, 1A Low Component Count Step-Down Regulator 8-SOIC -40 to 125; Manufacturer: TI National Semiconductor; Designed By: Arda B.; Number of Outputs: 1; Output Voltage: 12V; Efficiency: 94%; Min Input Voltage: 8V; Switching Frequency: 260kHz; Quiescent Current: 2.5mA; Output Type: Fixed; Supplier: Digi-Key; Supplier Part Number: 296-35410-6-ND; Manufacturer Part Number: LM2675MX-12/NOPB; RoHS: Yes; Category: Voltage Regulators - Switching; Pricing: 1=4,71, 10=4,231, 25=3,9996, 100=3,4663, 250=3,28856, 500=2,95082, 1000=2,48864 (USD); Mounting Technology: Surface Mount; Case/Package: SOIC N; Pins: 8; Min Operating Temperature: -40°C; Max Operating Temperature: 125°C; Output Current: 1A; Packaging: Tape and Reel; Max Output current: 1A; Max Supply Voltage: 40V; Package Quantity: 2500; Operating Supply Voltage: 40V; Series: LM2675; Radiation Hardening: No; Lead Free: Lead Free; RoHS Compliant: Yes; ComponentLink1URL: https://datasheet.ciiva.com/41457/001013881-da-01-en-ic-reg-buck-lm2675mx-12-nopb-soic-8-tid-41457896.pdf?src-supplier=Conrad; ComponentLink1Description: https://datasheet.ciiva.com/41457/001013881-da-01-en-ic-reg-buck-lm2675mx-12-nopb-soic-8-tid-41457896.pdf?src-supplier=Conrad; ComponentLink2URL: https://datasheet.ciiva.com/3220/lm2675-3220840.pdf?src-supplier=Avnet; ComponentLink2Description: https://datasheet.ciiva.com/3220/lm2675-3220840.pdf?src-supplier=Avnet
U2 = AP7361-33E-13: AP7361 Series 3.3 V 1 A Low SMT Dropout Fixed-Mode Regulator - SOT-223; Manufacturer: Diodes; Number of Outputs: 1; Min Input Voltage: 2.2V; Max Supply Voltage: 6V; Max Output current: 1A; Output Voltage: 3.3V; Max Power Dissipation: 1.1W; Dropout Voltage: 500mV; Min Current Limit: 1.1A; Polarity: Positive; Quiescent Current: 70uA; Power Dissipation: 1.1kW; Accuracy: 1%; Power Supply Rejection Ratio (PSRR): 65dB; Reference Voltage: 800mV; Output Type: Fixed; Designet By: Arda B.; Supplier: Future Electronics; Supplier Part Number: 4058800; Manufacturer Part Number: AP7361-33E-13; RoHS: Yes; Category: Voltage Regulators - Linear; Stock: 30000; Pricing: 2500=0,102, 7500=0,0986, 12500=0,0969, 50000=0,0923, 75000=0,0895 (USD); Mounting Technology: Surface Mount; Case/Package: SOT-223; Pins: 4; Weight: 0.000282oz; Contact Plating: Tin,Matte; Min Operating Temperature: -40°C; Max Operating Temperature: 85°C; Package Quantity: 1; Packaging: Tape and Reel; Output Current: 1A; Number of Regulators: 1; Series: -; Radiation Hardening: No; Reach SVHC Compliant: Yes; Lead Free: Lead Free; RoHS Compliant: Yes; ComponentLink1URL: https://datasheet.ciiva.com/26926/getdatasheetpartid-670786-26926141.pdf?src-supplier=Verical; ComponentLink1Description: https://datasheet.ciiva.com/26926/getdatasheetpartid-670786-26926141.pdf?src-supplier=Verical; ComponentLink2URL: https://datasheet.ciiva.com/29568/ap7361-29568378.pdf?src-supplier=Digi-Key; ComponentLink2Description: https://datasheet.ciiva.com/29568/ap7361-29568378.pdf?src-supplier=Digi-Key
USB1 = MİCRO B USB CONN: 2.50mm Pitch, Mini-Lock Receptacle Crimp Housing, Single Row, Positive Lock, 2 Circuits, Natural; Manufacturer: Molex; Manufacturer Part Number: 51103-0200; Designed By: Arda B.; Supplier: Digi-Key; Supplier Part Number: WM3335-ND; RoHS: Yes; Category: Headers and Wire Housings; Stock: 147538; Pricing: 1=0,19, 10=0,135, 100=0,0965, 1000=0,08102, 2500=0,0733 (USD); ComponentLink1URL: https://datasheet.ciiva.com/16743/0511030200-crimp-housings-16743717.pdf?; ComponentLink1Description: https://datasheet.ciiva.com/16743/0511030200-crimp-housings-16743717.pdf?